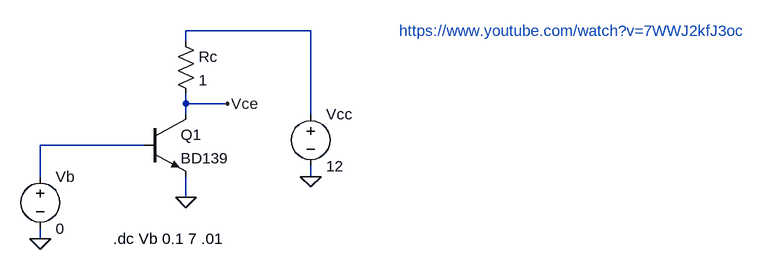
[diagram p0: schematic BD139 Input Characteristic Curve.asc]
BD139 Input Characteristic Curve.asc, the LTspice schematic file:
Version 4
SHEET 1 1232 680
WIRE 448 16 256 16
WIRE 256 32 256 16
WIRE 256 128 256 112
WIRE 320 128 256 128
WIRE 256 144 256 128
WIRE 448 144 448 16
WIRE 192 192 32 192
WIRE 32 240 32 192
WIRE 448 240 448 224
WIRE 256 272 256 240
WIRE 32 336 32 320
FLAG 256 272 0
FLAG 448 240 0
FLAG 32 336 0
FLAG 320 128 Vce
SYMBOL npn 192 144 R0
SYMATTR InstName Q1
SYMATTR Value BD139
SYMBOL voltage 448 128 R0
WINDOW 123 0 0 Left 2
WINDOW 39 0 0 Left 2
SYMATTR InstName Vcc
SYMATTR Value 12
SYMBOL res 240 16 R0
SYMATTR InstName Rc
SYMATTR Value 1
SYMBOL voltage 32 224 R0
WINDOW 123 0 0 Left 2
WINDOW 39 0 0 Left 2
SYMATTR InstName Vb
SYMATTR Value 0
TEXT 144 336 Left 2 !.dc Vb 0.1 7 .01
TEXT 584 16 Left 2 ;https://www.youtube.com/watch?v=7WWJ2kfJ3oc

The netlist it stands for:
* BD139 Input Characteristic Curve.asc
Q1 Vce N002 0 0 BD139
Vcc N001 0 12
Rc N001 Vce 1
Vb N002 0 0
.model NPN NPN
.model PNP PNP
.lib standard.bjt
.dc Vb 0.1 7 .01
* https://www.youtube.com/watch?v=7WWJ2kfJ3oc
.backanno
.end